# Altium schematic sheet Sheet2.SchDoc
size A3; SheetNumber: 1; SheetTotal: 1
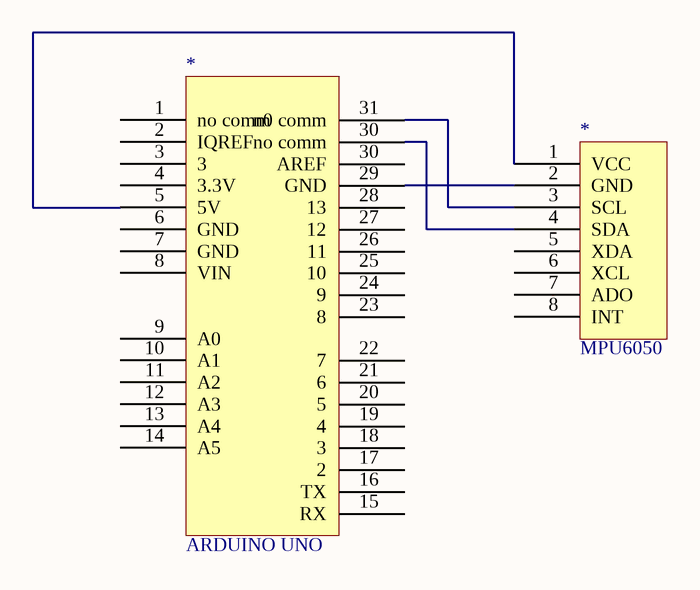
[diagram p0: Sheet2.SchDoc]

## Parts
(Parts that share a designator on the sheet are numbered #1, #2 ... from top to bottom, then left to right.)
*#1  ARDUINO UNO  [ARDUINO UNO]
*#2  MPU6050  [mpu6050]

## Nets
Net*#1_5: *#1.5(5V) *#2.1(VCC)
Net*#1_29: *#1.29(GND) *#2.2(GND)
Net*#1_30: *#1.30(AREF) *#2.4(SDA)
Net*#1_31: *#1.31(n0_comm) *#2.3(SCL)

Not connected (* = marked no-connect by the designer): *#1 1(no_comm) 2(IQREF) 3 4(3.3V) 6(GND) 7(GND) 8(VIN) 9(A0) 10(A1) 11(A2) 12(A3) 13(A4) 14(A5) 15(RX) 16(TX) 17(2) 18(3) 19(4) 20(5) 21(6) 22(7) 23(8) 24(9) 25(10) 26(11) 27(12) 28(13); *#2 5(XDA) 6(XCL) 7(ADO) 8(INT)